# Altium schematic sheet Ethernet_Connector.SchDoc
size A3; SheetNumber: 6; SheetTotal: 9
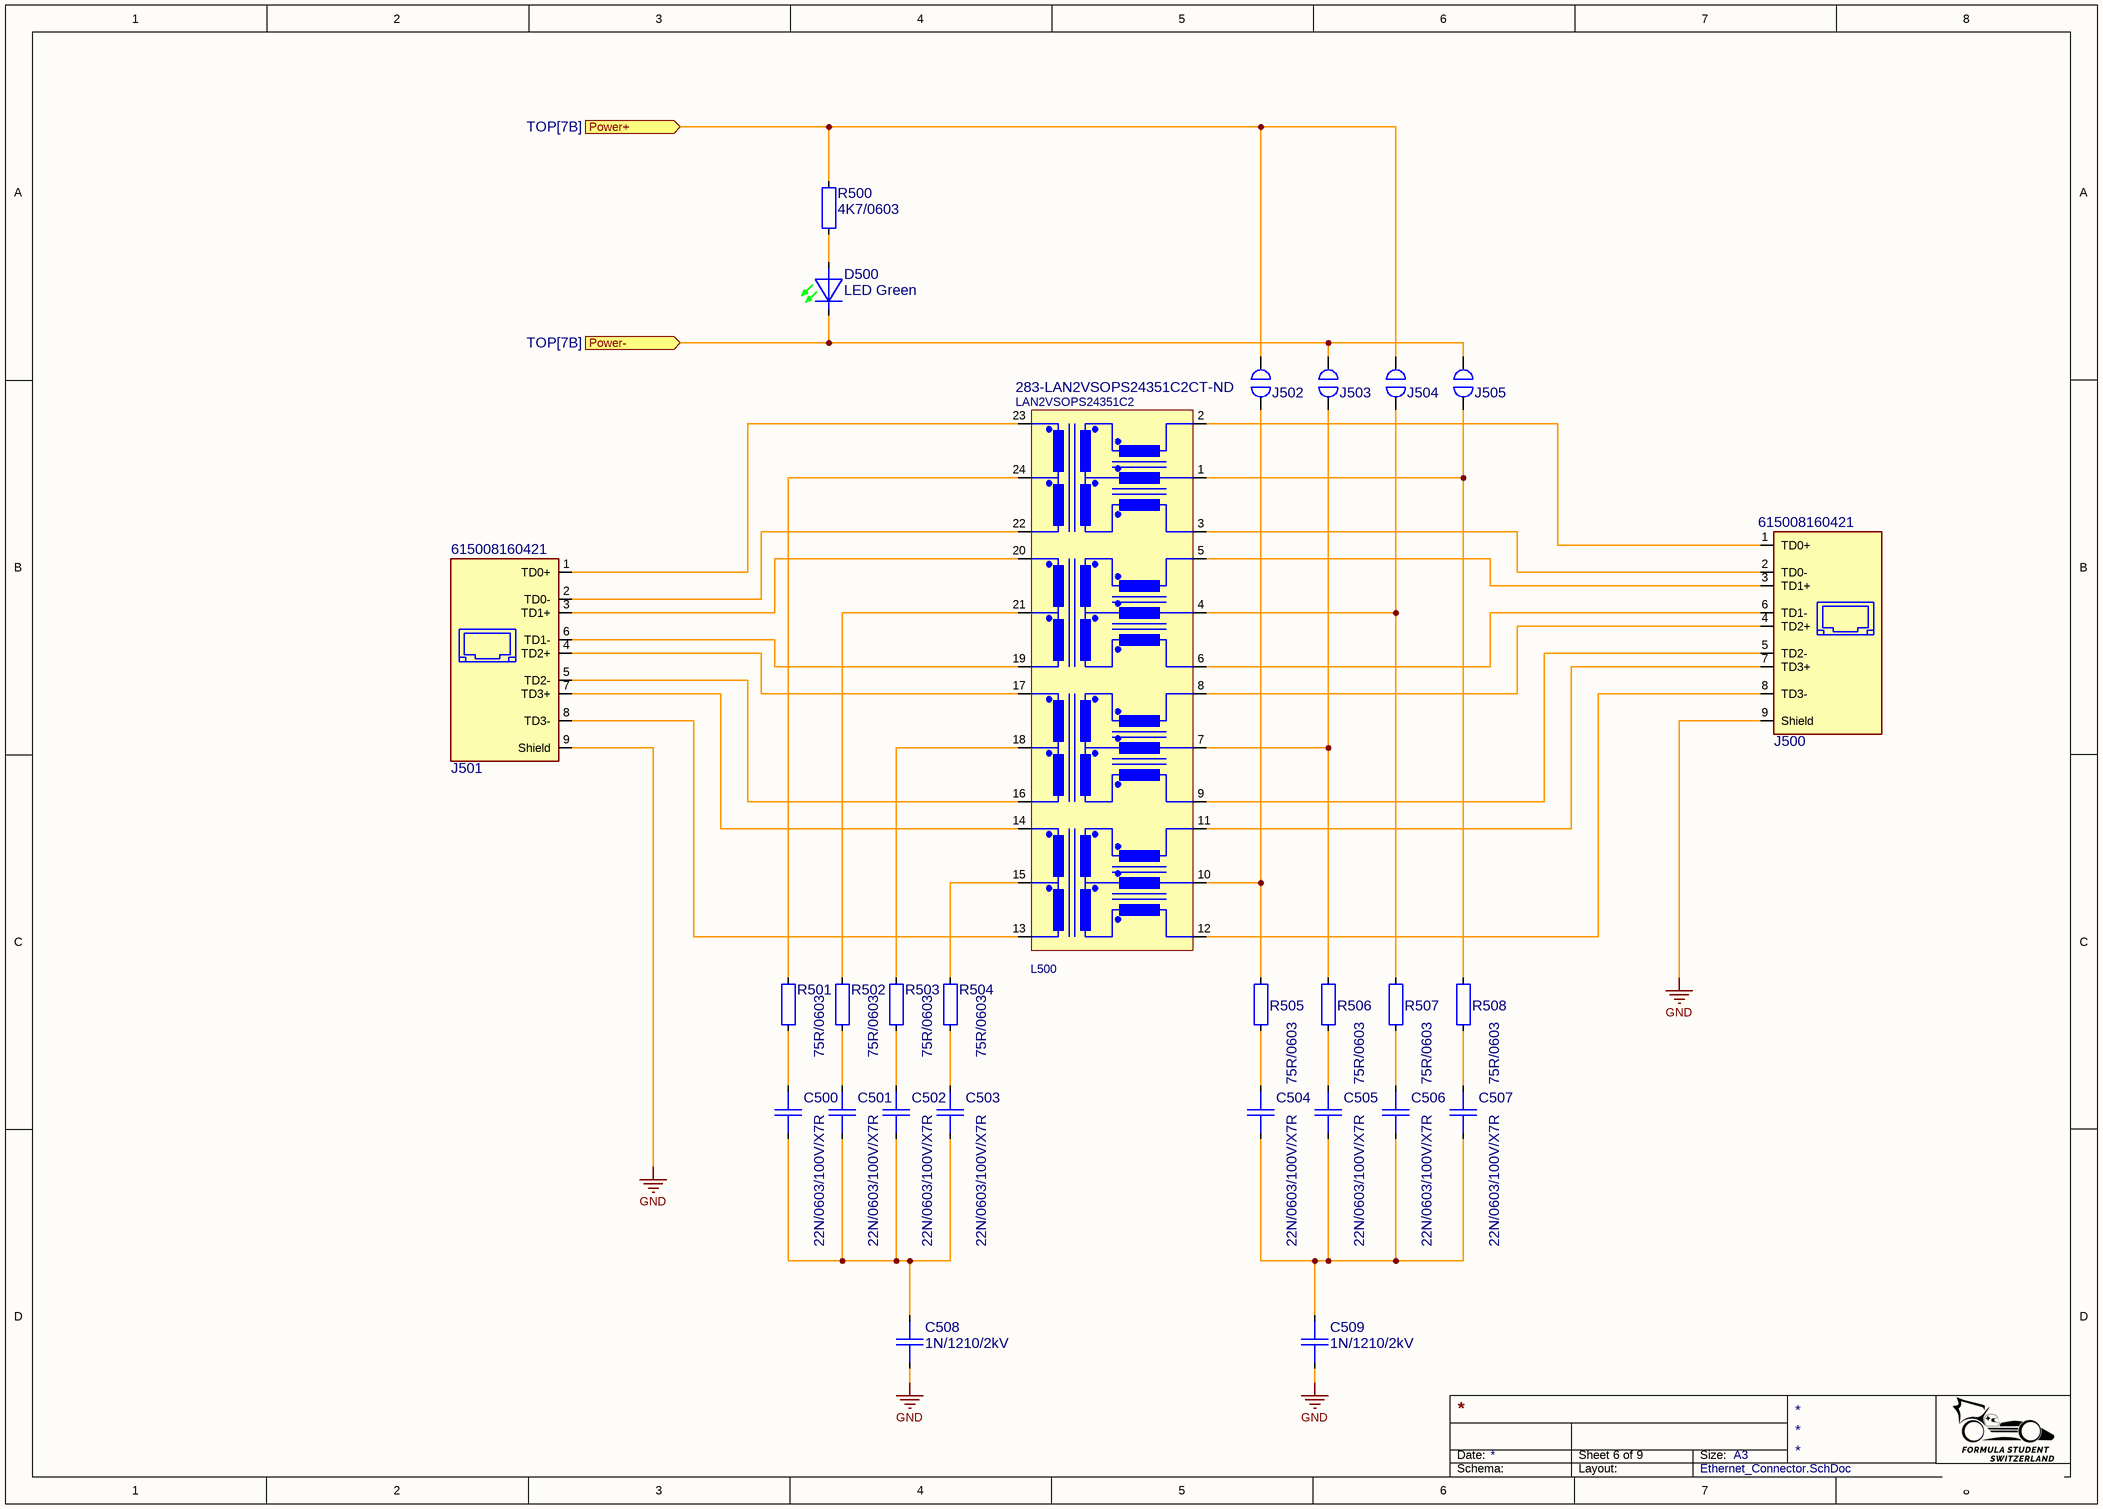
[diagram p0: Ethernet_Connector.SchDoc]

## Parts
C500  22N/0603/100V/X7R  [CAP0603_X7R]
C501  22N/0603/100V/X7R  [CAP0603_X7R]
C502  22N/0603/100V/X7R  [CAP0603_X7R]
C503  22N/0603/100V/X7R  [CAP0603_X7R]
C504  22N/0603/100V/X7R  [CAP0603_X7R]
C505  22N/0603/100V/X7R  [CAP0603_X7R]
C506  22N/0603/100V/X7R  [CAP0603_X7R]
C507  22N/0603/100V/X7R  [CAP0603_X7R]
C508  1N/1210/2kV  [CAP1210_X7R]
C509  1N/1210/2kV  [CAP1210_X7R]
D500  LED Green  [LED0603_GREEN]
J500  615008160421  [ETH_615008160421]
J501  615008160421  [ETH_615008160421]
J502  Solder Jumper 2pin 0.2mm small  [Solder_Jumper_2pin_0.2mm_small]  (value not drawn)
J503  Solder Jumper 2pin 0.2mm small  [Solder_Jumper_2pin_0.2mm_small]  (value not drawn)
J504  Solder Jumper 2pin 0.2mm small  [Solder_Jumper_2pin_0.2mm_small]  (value not drawn)
J505  Solder Jumper 2pin 0.2mm small  [Solder_Jumper_2pin_0.2mm_small]  (value not drawn)
L500  LAN2VSOPS24351C2  Supplier Part Number 1: 283-LAN2VSOPS24351C2CT-ND  [IND127P1600X620-24]
R500  4K7/0603  [R0603-0.40-WW]
R501  75R/0603  [R0603-0.40-WW]
R502  75R/0603  [R0603-0.40-WW]
R503  75R/0603  [R0603-0.40-WW]
R504  75R/0603  [R0603-0.40-WW]
R505  75R/0603  [R0603-0.40-WW]
R506  75R/0603  [R0603-0.40-WW]
R507  75R/0603  [R0603-0.40-WW]
R508  75R/0603  [R0603-0.40-WW]

## Ports
Power+ (in, see TOP[7B]), Power- (in, see TOP[7B])

## Nets
GND: C508.2 C509.2 J500.9(Shield) J501.9(Shield)
Power+: J502.1 J504.1 R500.2 ; port Power+
Power-: D500.1 J503.1 J505.1 ; port Power-
NetC500_1: C500.1 R501.2
NetC500_2: C500.2 C501.2 C502.2 C503.2 C508.1
NetC501_1: C501.1 R502.2
NetC502_1: C502.1 R503.2
NetC503_1: C503.1 R504.2
NetC504_1: C504.1 R505.2
NetC504_2: C504.2 C505.2 C506.2 C507.2 C509.1
NetC505_1: C505.1 R506.2
NetC506_1: C506.1 R507.2
NetC507_1: C507.1 R508.2
NetD500_2: D500.2 R500.1
NetJ500_1: J500.1(TD0+) L500.2
NetJ500_2: J500.2(TD0-) L500.3
NetJ500_3: J500.3(TD1+) L500.5
NetJ500_4: J500.4(TD2+) L500.8
NetJ500_5: J500.5(TD2-) L500.9
NetJ500_6: J500.6(TD1-) L500.6
NetJ500_7: J500.7(TD3+) L500.11
NetJ500_8: J500.8(TD3-) L500.12
NetJ501_1: J501.1(TD0+) L500.23
NetJ501_2: J501.2(TD0-) L500.22
NetJ501_3: J501.3(TD1+) L500.20
NetJ501_4: J501.4(TD2+) L500.17
NetJ501_5: J501.5(TD2-) L500.16
NetJ501_6: J501.6(TD1-) L500.19
NetJ501_7: J501.7(TD3+) L500.14
NetJ501_8: J501.8(TD3-) L500.13
NetJ502_2: J502.2 L500.10 R505.1
NetJ503_2: J503.2 L500.7 R506.1
NetJ504_2: J504.2 L500.4 R507.1
NetJ505_2: J505.2 L500.1 R508.1
NetL500_15: L500.15 R504.1
NetL500_18: L500.18 R503.1
NetL500_21: L500.21 R502.1
NetL500_24: L500.24 R501.1

## Notes on the sheet
- Date:
- Size:
- A3
- Schema:
- Layout:

## Library data of the parts
C500-C507 = 22N/0603/100V/X7R: CAP SM 0603 22nF 100V X7R; Manufacturer: GENERIC; Manufacturer 1: KEMET; Manufacturer Part Number 1: C0603C223K1RAC7867; Absolute Value: 2.2E-8; Eurocircuits GPN: GPC0603223-100; Part Number: 22N/0603/100V/X7R; Package: 0603; Value: 22nF; HelpURL: https://connect.kemet.com:7667/gateway/IntelliData-ComponentDocumentation/1.0/download/datasheet/C0603C223K1RACTU; Supplier 1: Digi-Key; Supplier Part Number 1: 399-C0603C223K1RAC7867CT-ND; Manufacturer Part Number 3: 0603B223K101CT; Supplier 3: LCSC; Supplier Part Number 3: C388010
C508 C509 = 1N/1210/2kV: CAP SM 1210 1nF 2kV; Manufacturer: GENERIC; Manufacturer 1: Holy Stone Enterprise Co., Ltd.; Manufacturer Part Number 1: C1210X102K202T; Value: 1N; Absolute Value: 1E-9; Part Number: 1N/1210/2kV; Package: 1210; HelpURL: https://www.holystone.com.tw/downloads/series/10000/1000/45/20220530174254_file1.pdf; Supplier 1: Digi-Key; Supplier Part Number 1: 4587-C1210X102K202TCT-ND; Manufacturer Part Number 3: 1210B102K202NT; Supplier 3: LCSC; Supplier Part Number 3: C2836780
D500 = LED Green 0603: Generic LED Green 0603; Manufacturer 1: Würth; Manufacturer Part Number 1: 150060VS75000; Part Number: LED Green 0603; Manufacturer: GENERIC; Package: 603; Value: Green; Absolute Value: Green; HelpURL: https://www.we-online.com/katalog/datasheet/150060VS75000.pdf; Supplier 1: Digi-Key; Supplier Part Number 1: 732-4980-1-ND; Manufacturer 3: Everlight Elec; Manufacturer Part Number 3: 19-217/GHC-YR1S2/3T; Supplier 3: LCSC; Supplier Part Number 3: C72043; JLC Type: Basic
J500 J501 = ETH_THT_Vert_Schielded: CONN MOD JACK 8P8C VERT SHIELDED; Manufacturer: GENERIC; Manufacturer 1: Würth; Previous Identity: RJ45 Buchse, Gigabit Ethernet; Package Type: HALO/PBL HFJ11-1G41E-L12RL; Part Number: ETH_THT_Vert_Schielded; HelpURL: https://www.we-online.com/components/products/datasheet/615008160421.pdf; Manufacturer Part Number 1: 615008160421; Supplier 1: Digi-Key; Supplier Part Number 1: 732-615008160421-ND; Manufacturer 3: HCTL; Manufacturer Part Number 3: HC-RJ45-5224-1-4; Supplier 3: LCSC; Supplier Part Number 3: C3010560
J502-J505 = Solder_Jumper_2pin_0.2mm_small: Solder jumper with two pins with a spacing of 0.2mm; Manufacturer: NONE; Part Number: Solder_Jumper_2pin_0.2mm_small
L500 = LAN2VSOPS24351C2: 350µH LAN 1000 Base-T, Power over Ethernet (PoE) Pulswandler 1CT:1CT Oberflächenmontage; Manufacturer: Eaton; Part Number: LAN2VSOPS24351C2; HelpURL: https://www.eaton.com/content/dam/eaton/products/electronic-components/resources/data-sheet/eaton-lan2vsop-1000-base-t-lan-transformer-poe-data-sheet-elx1376-en.pdf; Manufacturer 1: Eaton; Manufacturer Part Number 1: LAN2VSOPS24351C2; Manufacturer 3: CND-tek; Manufacturer Part Number 3: G2412S; Supplier 3: LCSC; Supplier Part Number 3: C2912224; Supplier 1: DigiKey
R500 = 4K7/0603: RES SM 0603 4K7; Manufacturer: GENERIC; Manufacturer 1: YAGEO; Manufacturer Part Number 1: RC0603FR-134K7L; Absolute Value: 4700; Eurocircuits GPN: GPR06034K7; Part Number: 4K7/0603; Package: 0603; Value: 4K7; HelpURL: https://www.yageo.com/upload/media/product/app/datasheet/rchip/pyu-rc_group_51_rohs_l.pdf; Supplier 1: Digi-Key; Supplier Part Number 1: 13-RC0603FR-134K7LCT-ND; Manufacturer 2: YAGEO; Manufacturer Part Number 2: RC0603FR-104K7L; Supplier 2: Digi-Key; Supplier Part Number 2: 13-RC0603FR-104K7LCT-ND; Manufacturer 3: UNI-ROYAL(Uniroyal Elec); Manufacturer Part Number 3: 0603WAF4701T5E; Supplier 3: LCSC; Supplier Part Number 3: C23162; JLC Type: Basic
R501-R508 = 75R/0603: RES SM 0603 75R; Manufacturer: GENERIC; Manufacturer 1: YAGEO; Manufacturer Part Number 1: RC0603FR-1375RL; Absolute Value: 75; Eurocircuits GPN: GPR060375R; Part Number: 75R/0603; Package: 0603; Value: 75R; HelpURL: https://www.yageo.com/upload/media/product/productsearch/datasheet/rchip/PYu-RC_Group_51_RoHS_L_12.pdf; Supplier 1: Digi-Key; Supplier Part Number 1: 13-RC0603FR-1375RLCT-ND; Manufacturer 2: YAGEO; Manufacturer Part Number 2: RC0603FR-1075RL; Supplier 2: Digi-Key; Supplier Part Number 2: 13-RC0603FR-1075RLCT-ND; Supplier 3: LCSC; Supplier Part Number 3: C112309